# Altium schematic sheet mux side A (1-4).SchDoc
size E; SheetNumber: 2; SheetTotal: 4
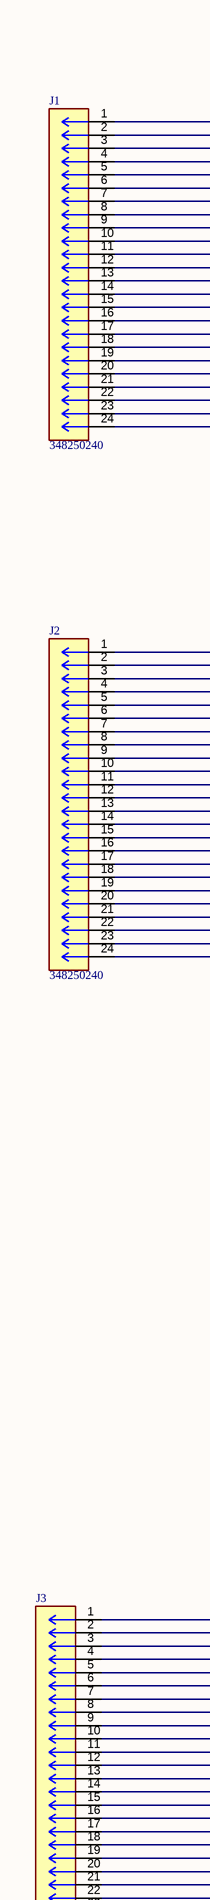
[diagram p0: mux side A (1-4).SchDoc, top left]
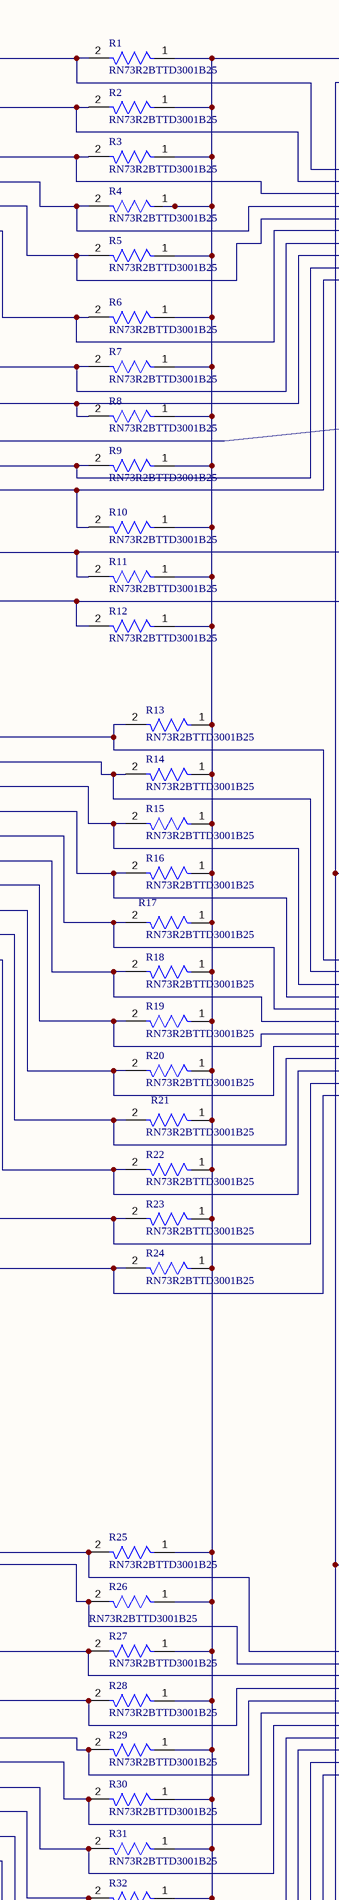
[diagram p1: mux side A (1-4).SchDoc, top middle]
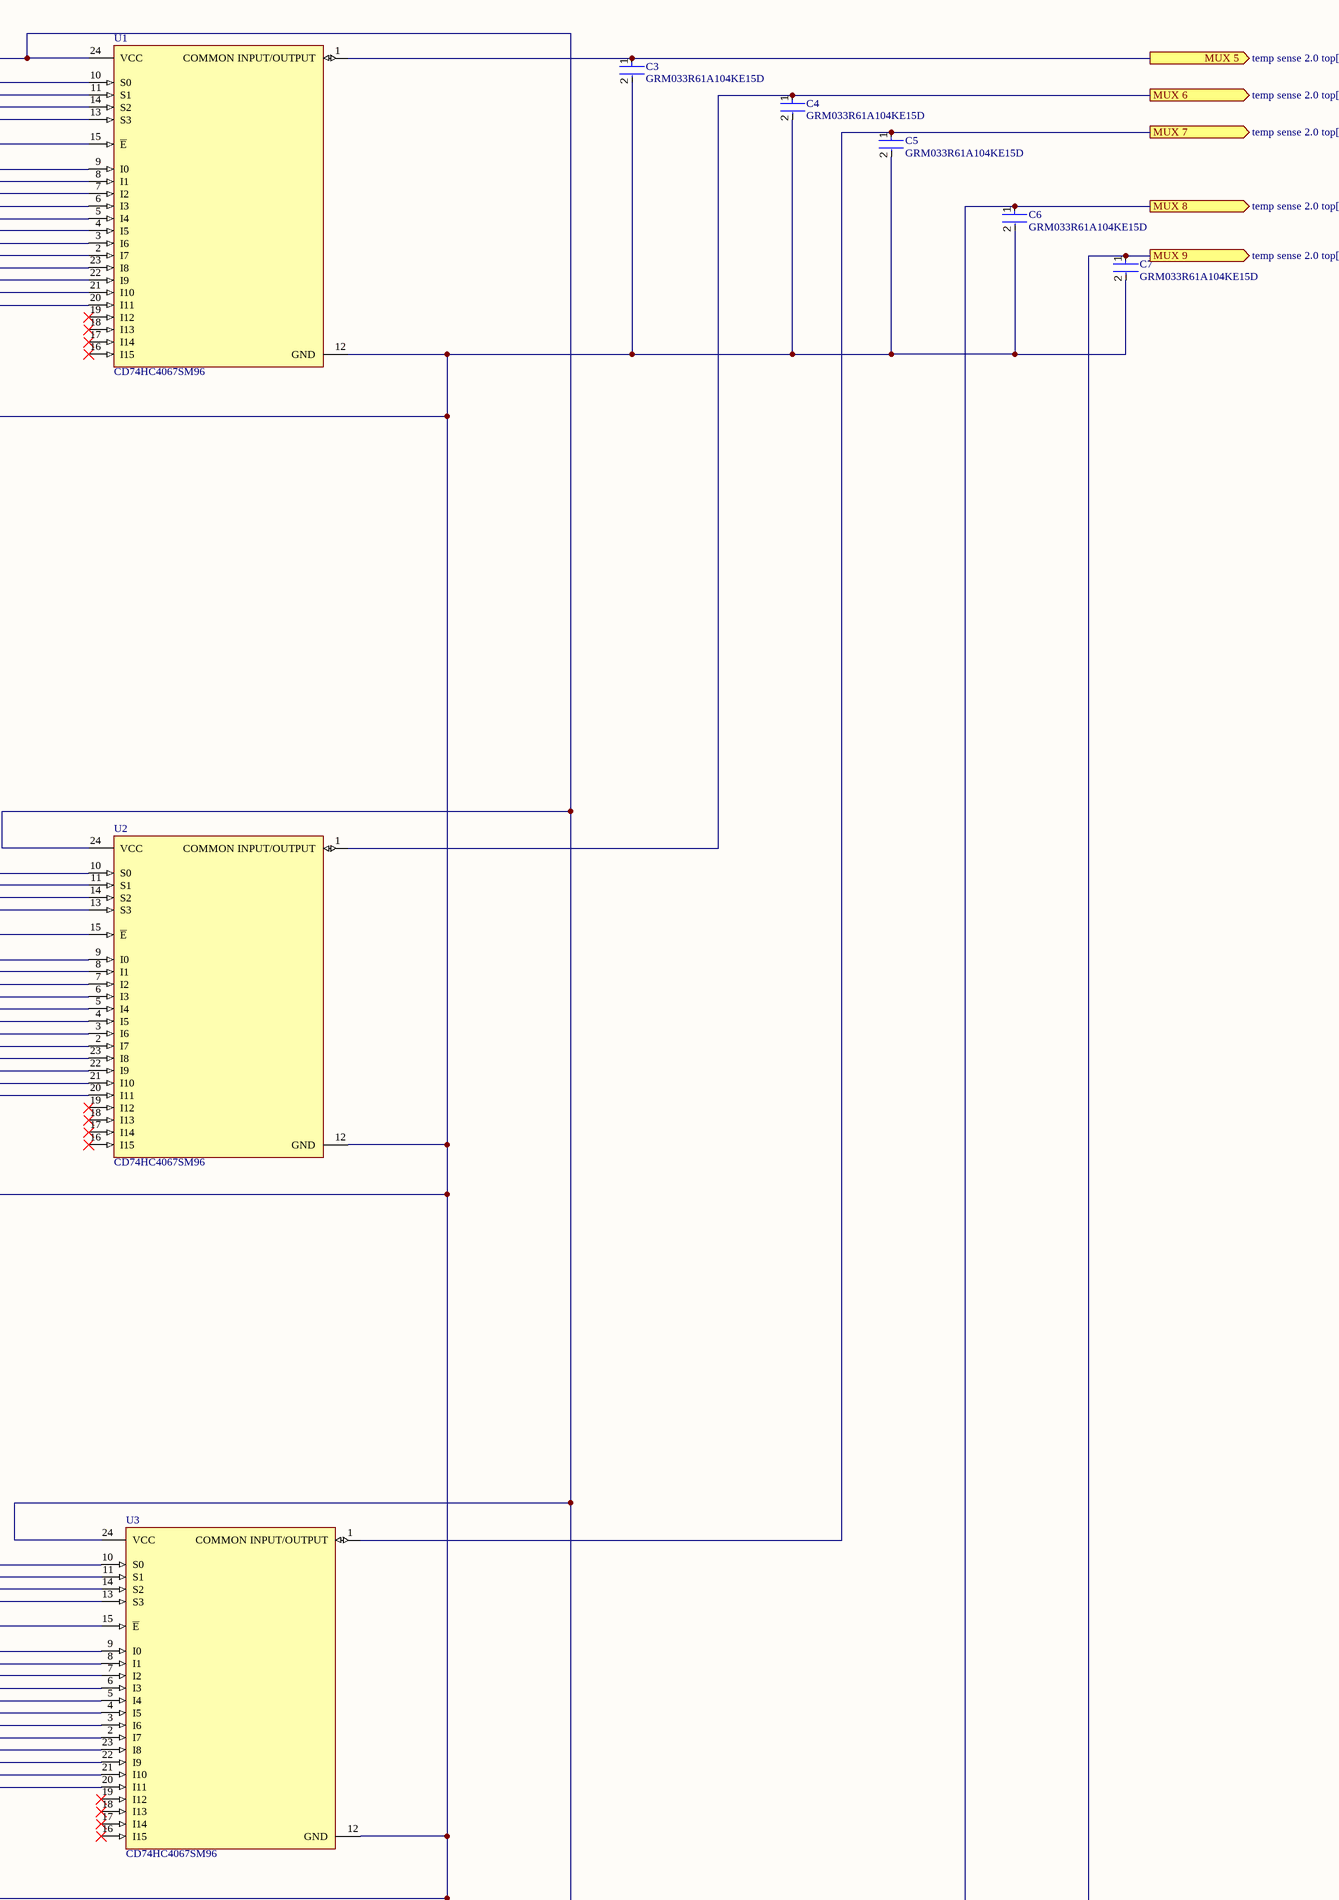
[diagram p2: mux side A (1-4).SchDoc, top right]
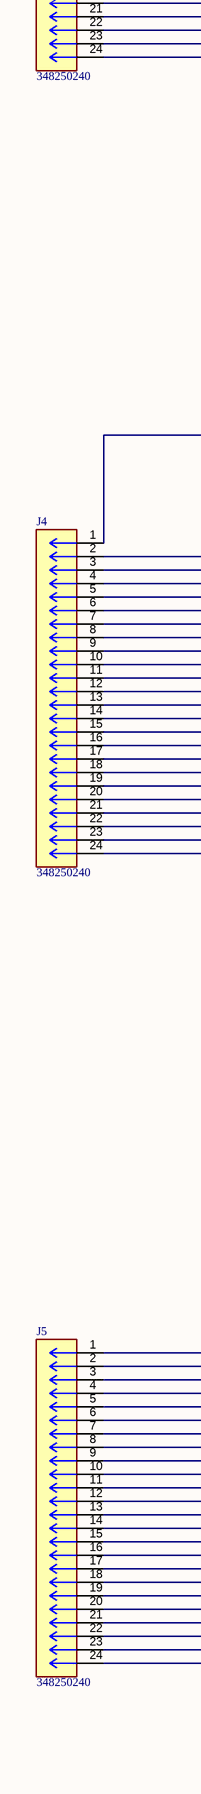
[diagram p3: mux side A (1-4).SchDoc, bottom left]
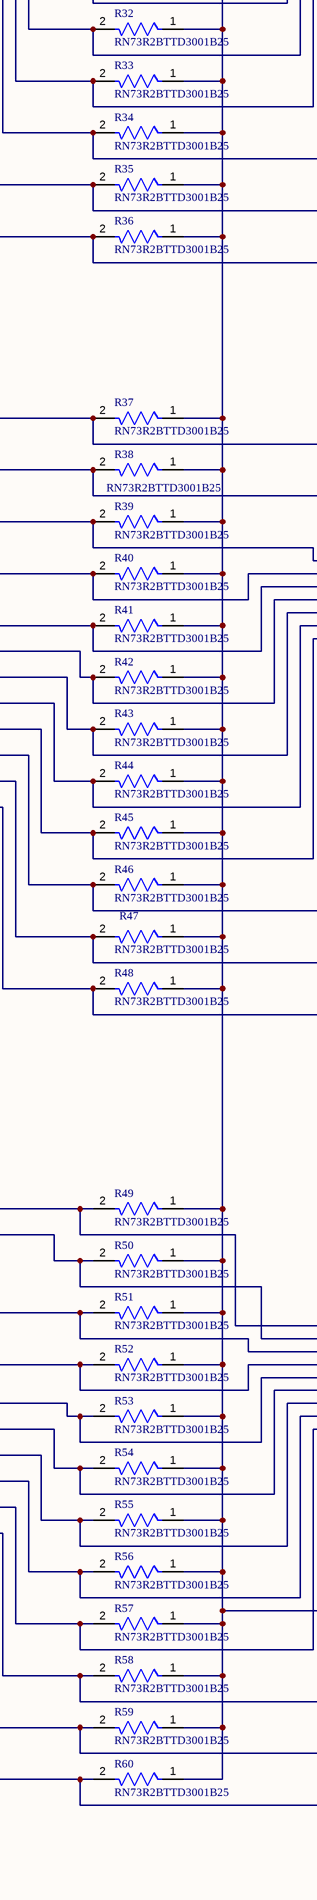
[diagram p4: mux side A (1-4).SchDoc, bottom middle]
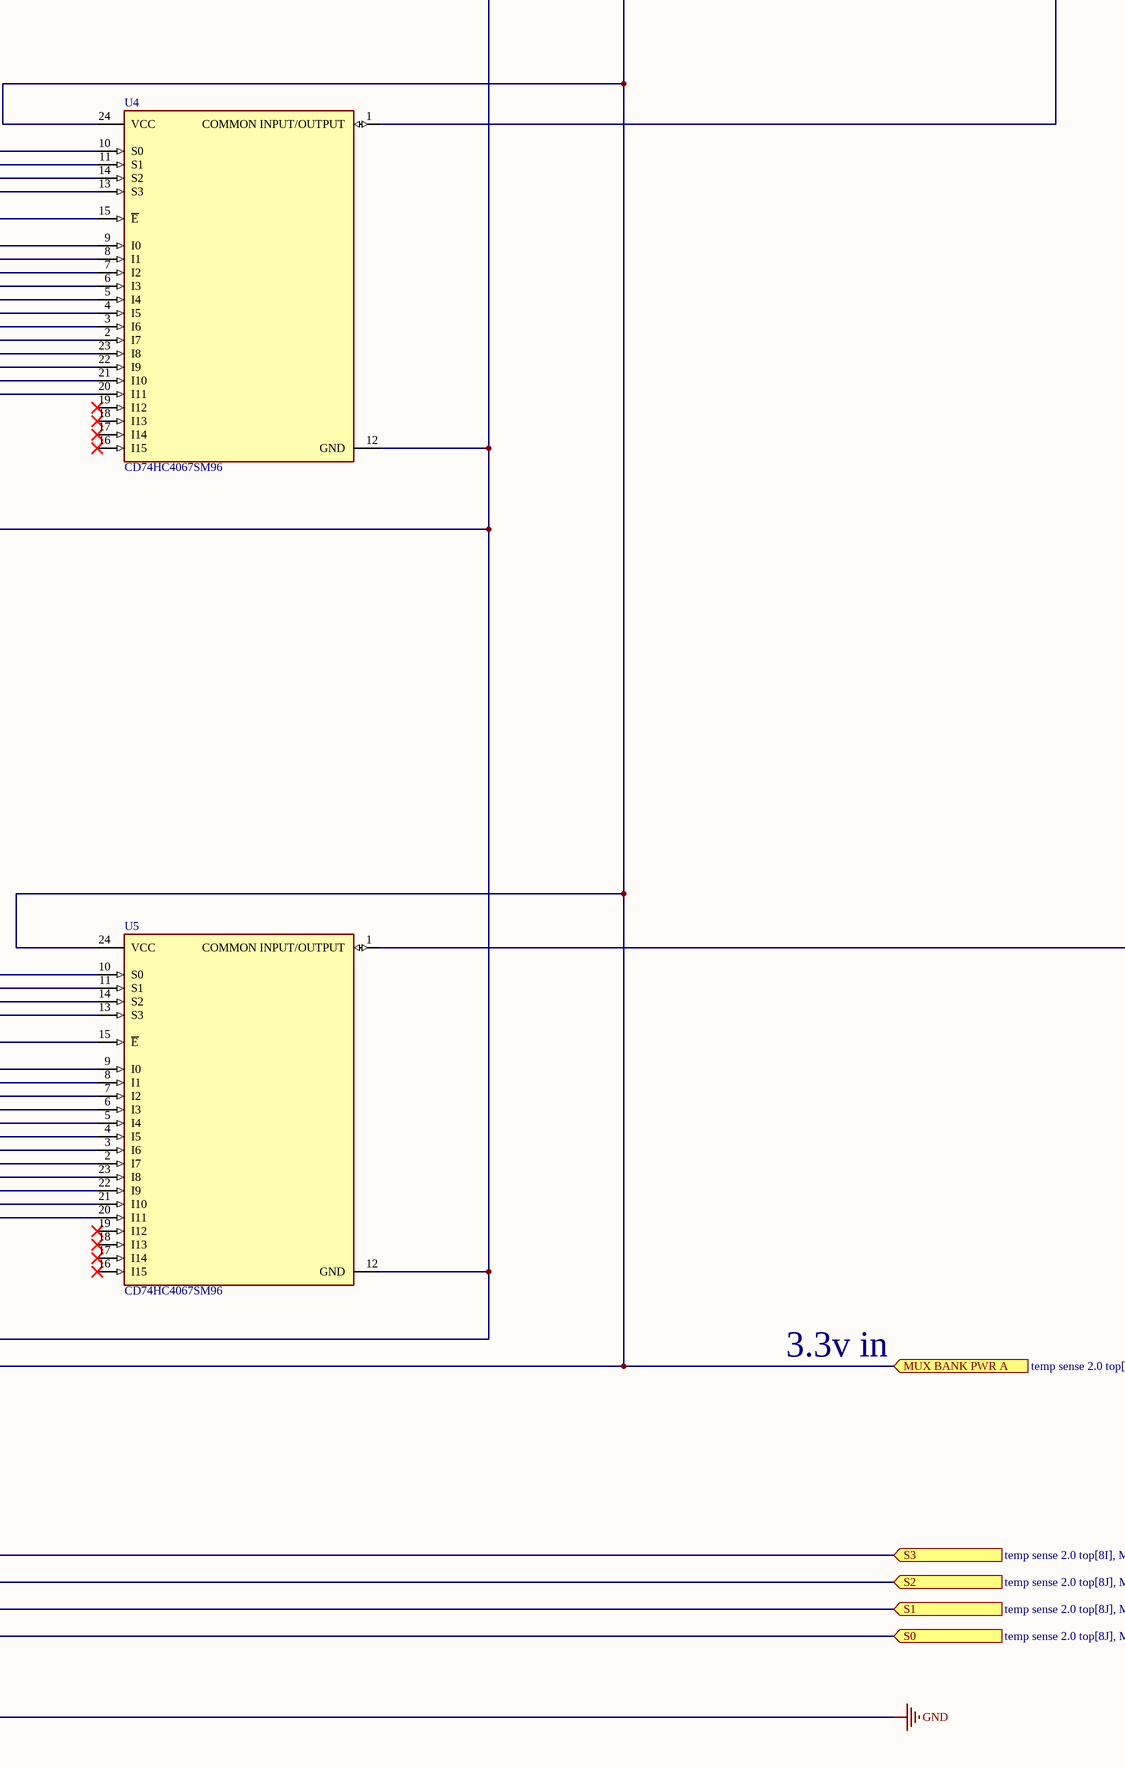
[diagram p5: mux side A (1-4).SchDoc, bottom right]

## Parts
C3  GRM033R61A104KE15D  [FP-GRM033-0_03-IPC_C]
C4  GRM033R61A104KE15D  [FP-GRM033-0_03-IPC_C]
C5  GRM033R61A104KE15D  [FP-GRM033-0_03-IPC_C]
C6  GRM033R61A104KE15D  [FP-GRM033-0_03-IPC_C]
C7  GRM033R61A104KE15D  [FP-GRM033-0_03-IPC_C]
J1  348250240  [CONN_SD-34825-001_24_MOL]
J2  348250240  [CONN_SD-34825-001_24_MOL]
J3  348250240  [CONN_SD-34825-001_24_MOL]
J4  348250240  [CONN_SD-34825-001_24_MOL]
J5  348250240  [CONN_SD-34825-001_24_MOL]
R1  RN73R2BTTD3001B25  [FP-RN73R2B-IPC_A]
R2  RN73R2BTTD3001B25  [FP-RN73R2B-IPC_A]
R3  RN73R2BTTD3001B25  [FP-RN73R2B-IPC_A]
R4  RN73R2BTTD3001B25  [FP-RN73R2B-IPC_A]
R5  RN73R2BTTD3001B25  [FP-RN73R2B-IPC_A]
R6  RN73R2BTTD3001B25  [FP-RN73R2B-IPC_A]
R7  RN73R2BTTD3001B25  [FP-RN73R2B-IPC_A]
R8  RN73R2BTTD3001B25  [FP-RN73R2B-IPC_A]
R9  RN73R2BTTD3001B25  [FP-RN73R2B-IPC_A]
R10  RN73R2BTTD3001B25  [FP-RN73R2B-IPC_A]
R11  RN73R2BTTD3001B25  [FP-RN73R2B-IPC_A]
R12  RN73R2BTTD3001B25  [FP-RN73R2B-IPC_A]
R13  RN73R2BTTD3001B25  [FP-RN73R2B-IPC_A]
R14  RN73R2BTTD3001B25  [FP-RN73R2B-IPC_A]
R15  RN73R2BTTD3001B25  [FP-RN73R2B-IPC_A]
R16  RN73R2BTTD3001B25  [FP-RN73R2B-IPC_A]
R17  RN73R2BTTD3001B25  [FP-RN73R2B-IPC_A]
R18  RN73R2BTTD3001B25  [FP-RN73R2B-IPC_A]
R19  RN73R2BTTD3001B25  [FP-RN73R2B-IPC_A]
R20  RN73R2BTTD3001B25  [FP-RN73R2B-IPC_A]
R21  RN73R2BTTD3001B25  [FP-RN73R2B-IPC_A]
R22  RN73R2BTTD3001B25  [FP-RN73R2B-IPC_A]
R23  RN73R2BTTD3001B25  [FP-RN73R2B-IPC_A]
R24  RN73R2BTTD3001B25  [FP-RN73R2B-IPC_A]
R25  RN73R2BTTD3001B25  [FP-RN73R2B-IPC_A]
R26  RN73R2BTTD3001B25  [FP-RN73R2B-IPC_A]
R27  RN73R2BTTD3001B25  [FP-RN73R2B-IPC_A]
R28  RN73R2BTTD3001B25  [FP-RN73R2B-IPC_A]
R29  RN73R2BTTD3001B25  [FP-RN73R2B-IPC_A]
R30  RN73R2BTTD3001B25  [FP-RN73R2B-IPC_A]
R31  RN73R2BTTD3001B25  [FP-RN73R2B-IPC_A]
R32  RN73R2BTTD3001B25  [FP-RN73R2B-IPC_A]
R33  RN73R2BTTD3001B25  [FP-RN73R2B-IPC_A]
R34  RN73R2BTTD3001B25  [FP-RN73R2B-IPC_A]
R35  RN73R2BTTD3001B25  [FP-RN73R2B-IPC_A]
R36  RN73R2BTTD3001B25  [FP-RN73R2B-IPC_A]
R37  RN73R2BTTD3001B25  [FP-RN73R2B-IPC_A]
R38  RN73R2BTTD3001B25  [FP-RN73R2B-IPC_A]
R39  RN73R2BTTD3001B25  [FP-RN73R2B-IPC_A]
R40  RN73R2BTTD3001B25  [FP-RN73R2B-IPC_A]
R41  RN73R2BTTD3001B25  [FP-RN73R2B-IPC_A]
R42  RN73R2BTTD3001B25  [FP-RN73R2B-IPC_A]
R43  RN73R2BTTD3001B25  [FP-RN73R2B-IPC_A]
R44  RN73R2BTTD3001B25  [FP-RN73R2B-IPC_A]
R45  RN73R2BTTD3001B25  [FP-RN73R2B-IPC_A]
R46  RN73R2BTTD3001B25  [FP-RN73R2B-IPC_A]
R47  RN73R2BTTD3001B25  [FP-RN73R2B-IPC_A]
R48  RN73R2BTTD3001B25  [FP-RN73R2B-IPC_A]
R49  RN73R2BTTD3001B25  [FP-RN73R2B-IPC_A]
R50  RN73R2BTTD3001B25  [FP-RN73R2B-IPC_A]
R51  RN73R2BTTD3001B25  [FP-RN73R2B-IPC_A]
R52  RN73R2BTTD3001B25  [FP-RN73R2B-IPC_A]
R53  RN73R2BTTD3001B25  [FP-RN73R2B-IPC_A]
R54  RN73R2BTTD3001B25  [FP-RN73R2B-IPC_A]
R55  RN73R2BTTD3001B25  [FP-RN73R2B-IPC_A]
R56  RN73R2BTTD3001B25  [FP-RN73R2B-IPC_A]
R57  RN73R2BTTD3001B25  [FP-RN73R2B-IPC_A]
R58  RN73R2BTTD3001B25  [FP-RN73R2B-IPC_A]
R59  RN73R2BTTD3001B25  [FP-RN73R2B-IPC_A]
R60  RN73R2BTTD3001B25  [FP-RN73R2B-IPC_A]
U1  CD74HC4067SM96  [FP-DB0024A-IPC_C]
U2  CD74HC4067SM96  [FP-DB0024A-IPC_C]
U3  CD74HC4067SM96  [FP-DB0024A-IPC_C]
U4  CD74HC4067SM96  [FP-DB0024A-IPC_C]
U5  CD74HC4067SM96  [FP-DB0024A-IPC_C]

## Ports
MUX 5 (out, see temp sense 2.0 top[8G], MCU[6F]), MUX 6 (out, see temp sense 2.0 top[8G], MCU[6F]), MUX 7 (out, see temp sense 2.0 top[8G], MCU[6F]), MUX 8 (out, see temp sense 2.0 top[8G], MCU[6E]), MUX 9 (out, see temp sense 2.0 top[8G], MCU[6E]), MUX BANK PWR A (in, see temp sense 2.0 top[8G], MCU[3C]), S0 (in, see temp sense 2.0 top[8J], MCU[4F], Mux side B (5-8)[3D]), S1 (in, see temp sense 2.0 top[8J], MCU[4F], Mux side B (5-8)[3D]), S2 (in, see temp sense 2.0 top[8J], MCU[4F], Mux side B (5-8)[3D]), S3 (in, see temp sense 2.0 top[8I], MCU[4F], Mux side B (5-8)[3D])

## Nets
GND: C3.2 C4.2 C5.2 C6.2 C7.2 J1.2 J1.4 J1.6 J1.8 J1.10 J1.12 J1.14 J1.16 J1.18 J1.20 J1.22 J1.24 J2.2 J2.4 J2.6 J2.8 J2.10 J2.12 J2.14 J2.16 J2.18 J2.20 J2.22 J2.24 J3.2 J3.4 J3.6 J3.8 J3.10 J3.12 J3.14 J3.16 J3.18 J3.20 J3.22 J3.24 J4.2 J4.4 J4.6 J4.8 J4.10 J4.12 J4.14 J4.16 J4.18 J4.20 J4.22 J4.24 J5.2 J5.4 J5.6 J5.8 J5.10 J5.12 J5.14 J5.16 J5.18 J5.20 J5.22 J5.24 U1.12(GND) U1.15(~{E}) U2.12(GND) U2.15(~{E}) U3.12(GND) U3.15(~{E}) U4.12(GND) U4.15(~{E}) U5.12(GND) U5.15(~{E})
MUX 5: C3.1 U1.1(COMMON_INPUT/OUTPUT) ; port MUX 5
MUX 6: C4.1 U2.1(COMMON_INPUT/OUTPUT) ; port MUX 6
MUX 7: C5.1 U3.1(COMMON_INPUT/OUTPUT) ; port MUX 7
MUX 8: C6.1 U4.1(COMMON_INPUT/OUTPUT) ; port MUX 8
MUX 9: C7.1 U5.1(COMMON_INPUT/OUTPUT) ; port MUX 9
MUX BANK PWR A: R1.1 R2.1 R3.1 R4.1 R5.1 R6.1 R7.1 R8.1 R9.1 R10.1 R11.1 R12.1 R13.1 R14.1 R15.1 R16.1 R17.1 R18.1 R19.1 R20.1 R21.1 R22.1 R23.1 R24.1 R25.1 R26.1 R27.1 R28.1 R29.1 R30.1 R31.1 R32.1 R33.1 R34.1 R35.1 R36.1 R37.1 R38.1 R39.1 R40.1 R41.1 R42.1 R43.1 R44.1 R45.1 R46.1 R47.1 R48.1 R49.1 R50.1 R51.1 R52.1 R53.1 R54.1 R55.1 R56.1 R57.1 R58.1 R59.1 R60.1 U1.24(VCC) U2.24(VCC) U3.24(VCC) U4.24(VCC) U5.24(VCC) ; port MUX BANK PWR A
S0: U1.10(S0) U2.10(S0) U3.10(S0) U4.10(S0) U5.10(S0) ; port S0
S1: U1.11(S1) U2.11(S1) U3.11(S1) U4.11(S1) U5.11(S1) ; port S1
S2: U1.14(S2) U2.14(S2) U3.14(S2) U4.14(S2) U5.14(S2) ; port S2
S3: U1.13(S3) U2.13(S3) U3.13(S3) U4.13(S3) U5.13(S3) ; port S3
NetJ1_1: J1.1 R1.2 U1.9(I0)
NetJ1_3: J1.3 R2.2 U1.8(I1)
NetJ1_5: J1.5 R3.2 U1.7(I2)
NetJ1_7: J1.7 R4.2 U1.6(I3)
NetJ1_9: J1.9 R5.2 U1.5(I4)
NetJ1_11: J1.11 R6.2 U1.4(I5)
NetJ1_13: J1.13 R7.2 U1.3(I6)
NetJ1_15: J1.15 R8.2 U1.2(I7)
NetJ1_17: J1.17 R9.2 U1.23(I8)
NetJ1_19: J1.19 R10.2 U1.22(I9)
NetJ1_21: J1.21 R11.2 U1.21(I10)
NetJ1_23: J1.23 R12.2 U1.20(I11)
NetJ2_1: J2.1 R13.2 U2.9(I0)
NetJ2_3: J2.3 R14.2 U2.8(I1)
NetJ2_5: J2.5 R15.2 U2.7(I2)
NetJ2_7: J2.7 R16.2 U2.6(I3)
NetJ2_9: J2.9 R17.2 U2.5(I4)
NetJ2_11: J2.11 R18.2 U2.4(I5)
NetJ2_13: J2.13 R19.2 U2.3(I6)
NetJ2_15: J2.15 R20.2 U2.2(I7)
NetJ2_17: J2.17 R21.2 U2.23(I8)
NetJ2_19: J2.19 R22.2 U2.22(I9)
NetJ2_21: J2.21 R23.2 U2.21(I10)
NetJ2_23: J2.23 R24.2 U2.20(I11)
NetJ3_1: J3.1 R25.2 U3.9(I0)
NetJ3_3: J3.3 R26.2 U3.8(I1)
NetJ3_5: J3.5 R27.2 U3.7(I2)
NetJ3_7: J3.7 R28.2 U3.6(I3)
NetJ3_9: J3.9 R29.2 U3.5(I4)
NetJ3_11: J3.11 R30.2 U3.4(I5)
NetJ3_13: J3.13 R31.2 U3.3(I6)
NetJ3_15: J3.15 R32.2 U3.2(I7)
NetJ3_17: J3.17 R33.2 U3.23(I8)
NetJ3_19: J3.19 R34.2 U3.22(I9)
NetJ3_21: J3.21 R35.2 U3.21(I10)
NetJ3_23: J3.23 R36.2 U3.20(I11)
NetJ4_1: J4.1 R37.2 U4.9(I0)
NetJ4_3: J4.3 R38.2 U4.8(I1)
NetJ4_5: J4.5 R39.2 U4.7(I2)
NetJ4_7: J4.7 R40.2 U4.6(I3)
NetJ4_9: J4.9 R41.2 U4.5(I4)
NetJ4_11: J4.11 R42.2 U4.4(I5)
NetJ4_13: J4.13 R43.2 U4.3(I6)
NetJ4_15: J4.15 R44.2 U4.2(I7)
NetJ4_17: J4.17 R45.2 U4.23(I8)
NetJ4_19: J4.19 R46.2 U4.22(I9)
NetJ4_21: J4.21 R47.2 U4.21(I10)
NetJ4_23: J4.23 R48.2 U4.20(I11)
NetJ5_1: J5.1 R49.2 U5.9(I0)
NetJ5_3: J5.3 R50.2 U5.8(I1)
NetJ5_5: J5.5 R51.2 U5.7(I2)
NetJ5_7: J5.7 R52.2 U5.6(I3)
NetJ5_9: J5.9 R53.2 U5.5(I4)
NetJ5_11: J5.11 R54.2 U5.4(I5)
NetJ5_13: J5.13 R55.2 U5.3(I6)
NetJ5_15: J5.15 R56.2 U5.2(I7)
NetJ5_17: J5.17 R57.2 U5.23(I8)
NetJ5_19: J5.19 R58.2 U5.22(I9)
NetJ5_21: J5.21 R59.2 U5.21(I10)
NetJ5_23: J5.23 R60.2 U5.20(I11)

Not connected (* = marked no-connect by the designer): U1 16(I15)* 17(I14)* 18(I13)* 19(I12)*; U2 16(I15)* 17(I14)* 18(I13)* 19(I12)*; U3 16(I15)* 17(I14)* 18(I13)* 19(I12)*; U4 16(I15)* 17(I14)* 18(I13)* 19(I12)*; U5 16(I15)* 17(I14)* 18(I13)* 19(I12)*

## Notes on the sheet
- 3.3v in
- THIS DOCUMENT AND THE DATA DISCLOSED HEREIN OR
- HEREWITH IS THE PROPERTY OF ALTIUM LIMITED AND MAY
- DWG NO:
- REVISION
- REV:
- DESCRIPTION
- DATE
- APPROVED
- BE FREELY DISTRIBUTED IN WHOLE. NO RIGHTS ARE
- RESERVED OR EXPRESS OR IMPLIED WARANTEE GIVEN.
- ENG:
- APPROVALS
- PROJECT
- DSN:
- CHK:
- REFERENCE DOCUMENTS
- PROJECT REVISION:
- TITLE
- DOCUMENT REVISION:
- DESIGN ITEM:
- BOM:
- FAB DWG:
- PCB DWG:
- ASSY DWG:
- SCALE:
- A3
- SIZE
- CAGE CODE
- FILE NAME
- DWG NO.
- SHEET
- OF
- REV

## Library data of the parts
C3-C7 = CMP-2010-01264-2: Chip Multilayer Ceramic Capacitors for General Purpose, 0201, 0.10uF, X5R, 15%, 10%, 10V; Capacitance: 100nF; Mount: Surface Mount; Dielectric: X5R; Width: 0.012inch; Tolerance: 10%; Radiation Hardening: No; Voltage Rating: 10V; REACH SVHC: No SVHC; Height: 0.3mm; Max Operating Temperature: 85°C; Voltage Rating (DC): 10V; Thickness: 0.013inch; Termination: SMD/SMT; Lead Free: Lead Free; Package Quantity: 1; Case/Package: 0201; Min Operating Temperature: -55°C; Weight: 6E-06oz; Length: 0.6mm; Case Code (Imperial): 0201; Depth: 0.3mm; Voltage: 10V; Packaging: Tape and Reel; Case Code (Metric): 0603
R1-R60 = CMP-04015-056270-1: 3kΩ ±0.1% 0.25W, 1/4W Chip Resistor 1206 (3216 Metric) Moisture Resistant Thin Film
U1-U5 = CMP-04892-000038-1: IC MUX/DEMUX 1X16 24SSOP; Supply Type: Single; High Level Output Current: 25mA; Min Supply Voltage: 2V; Number of Circuits: 16; Max Supply Voltage: 6V; Number of Channels: 1; Turn-On Delay Time: 300ns; Max Supply Current: 8uA; Bandwidth: 89MHz; Turn-Off Delay Time: 290ns; Propagation Delay: 75ns; Logic Function: Multiplexer; On-State Resistance: 160R; Polarity: Non-Inverting; Width: 5.3mm; Case/Package: SSOP; Max Operating Temperature: 125°C; Mount: Surface Mount; Min Operating Temperature: -55°C; REACH SVHC: No SVHC; Contact Plating: Gold; Max Output Current: 25mA; Weight: 0.006081oz; Height: 1.95mm; Package Quantity: 2000; Length: 8.2mm; Lead Free: Lead Free; Operating Supply Current: 8uA; Packaging: Tape and Reel; Series: 74HC; Low Level Output Current: 25mA; Number of Outputs: 1; Termination: SMD/SMT; Number of Inputs: 16; Number of Bits: 16; Radiation Hardening: No; Number of Pins: 24
J1-J5 = 348250240: Package: None; Price: None; Value: *; MP: 348250240; Availability: Unavailable